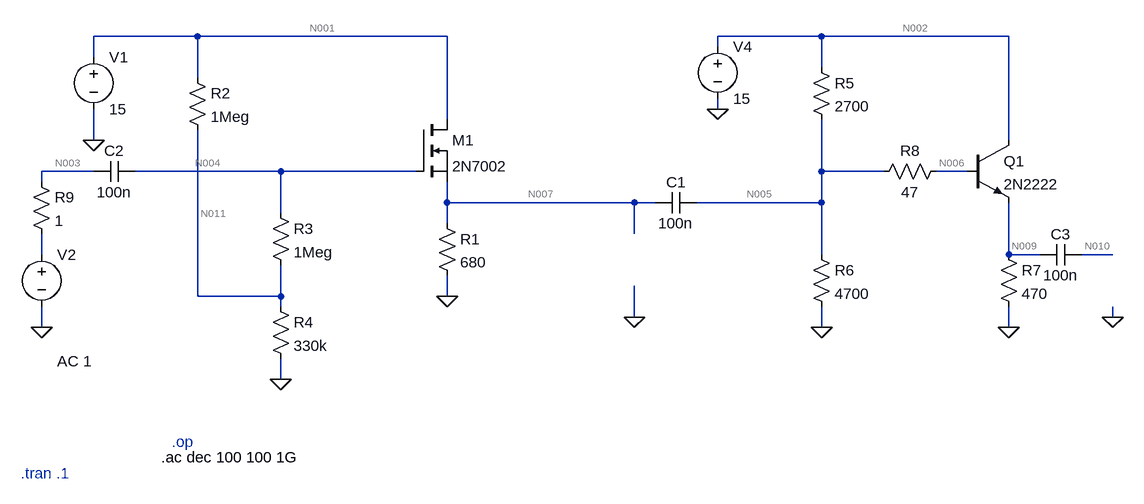
[diagram p0: schematic mosfet 2N7000.asc]
mosfet 2N7000.asc, the LTspice schematic file:
Version 4
SHEET 1 1596 1264
WIRE -176 0 -336 0
WIRE 208 0 -176 0
WIRE 784 0 624 0
WIRE 1072 0 784 0
WIRE 624 16 624 0
WIRE -336 32 -336 0
WIRE 784 48 784 0
WIRE -176 64 -176 0
WIRE 624 112 624 96
WIRE 208 128 208 0
WIRE -336 160 -336 112
WIRE 1072 160 1072 0
WIRE -336 208 -416 208
WIRE -48 208 -272 208
WIRE 160 208 -48 208
WIRE 784 208 784 128
WIRE 880 208 784 208
WIRE 1008 208 960 208
WIRE -416 224 -416 208
WIRE 208 256 208 224
WIRE 496 256 208 256
WIRE 528 256 496 256
WIRE 784 256 784 208
WIRE 784 256 592 256
WIRE -48 272 -48 208
WIRE 208 288 208 256
WIRE 496 304 496 256
WIRE -416 336 -416 304
WIRE 784 336 784 256
WIRE 1072 336 1072 256
WIRE 1120 336 1072 336
WIRE 1232 336 1184 336
WIRE -176 400 -176 144
WIRE -48 400 -48 352
WIRE -48 400 -176 400
WIRE 208 400 208 368
WIRE -48 416 -48 400
WIRE 496 432 496 384
WIRE 1232 432 1232 416
WIRE -416 448 -416 416
WIRE 784 448 784 416
WIRE 1072 448 1072 416
WIRE -48 528 -48 496
FLAG -336 160 0
FLAG -48 528 0
FLAG 208 400 0
FLAG 784 448 0
FLAG 1072 448 0
FLAG -416 448 0
FLAG 496 432 0
FLAG 624 112 0
FLAG 1232 432 0
SYMBOL nmos 160 128 R0
SYMATTR InstName M1
SYMATTR Value 2N7002
SYMBOL res 192 272 R0
SYMATTR InstName R1
SYMATTR Value 680
SYMBOL res -192 48 R0
SYMATTR InstName R2
SYMATTR Value 1Meg
SYMBOL res -64 256 R0
SYMATTR InstName R3
SYMATTR Value 1Meg
SYMBOL res -64 400 R0
SYMATTR InstName R4
SYMATTR Value 330k
SYMBOL res 768 32 R0
SYMATTR InstName R5
SYMATTR Value 2700
SYMBOL res 768 320 R0
SYMATTR InstName R6
SYMATTR Value 4700
SYMBOL res 1056 320 R0
SYMATTR InstName R7
SYMATTR Value 470
SYMBOL res 976 192 R90
WINDOW 0 0 56 VBottom 2
WINDOW 3 32 56 VTop 2
SYMATTR InstName R8
SYMATTR Value 47
SYMBOL npn 1008 160 R0
SYMATTR InstName Q1
SYMATTR Value 2N2222
SYMBOL voltage -336 16 R0
WINDOW 123 0 0 Left 0
WINDOW 39 0 0 Left 0
SYMATTR InstName V1
SYMATTR Value 15
SYMBOL voltage -416 320 R0
WINDOW 3 24 44 Left 2
WINDOW 123 24 180 Left 2
WINDOW 39 0 0 Left 0
SYMATTR Value ""
SYMATTR Value2 AC 1
SYMATTR InstName V2
SYMBOL cap 592 240 R90
WINDOW 0 0 32 VBottom 2
WINDOW 3 32 32 VTop 2
SYMATTR InstName C1
SYMATTR Value 100n
SYMBOL voltage 624 0 R0
WINDOW 123 0 0 Left 0
WINDOW 39 0 0 Left 0
SYMATTR InstName V4
SYMATTR Value 15
SYMBOL res -432 208 R0
SYMATTR InstName R9
SYMATTR Value 1
SYMBOL cap -272 192 R90
WINDOW 0 0 32 VBottom 2
WINDOW 3 32 32 VTop 2
SYMATTR InstName C2
SYMATTR Value 100n
SYMBOL cap 1184 320 R90
WINDOW 0 0 32 VBottom 2
WINDOW 3 32 32 VTop 2
SYMATTR InstName C3
SYMATTR Value 100n
TEXT -216 624 Left 2 ;.op
TEXT -232 648 Left 2 !.ac dec 100 100 1G
TEXT -448 672 Left 2 ;.tran .1

The netlist it stands for:
* mosfet 2N7000.asc
M1 N001 N004 N007 N007 2N7002
R1 N007 0 680
R2 N001 N011 1Meg
R3 N004 N011 1Meg
R4 N011 0 330k
R5 N002 N005 2700
R6 N005 0 4700
R7 N009 0 470
R8 N006 N005 47
Q1 N002 N006 N009 0 2N2222
V1 N001 0 15
V2 N008 0 AC 1
C1 N005 N007 100n
V4 N002 0 15
R9 N003 N008 1
C2 N004 N003 100n
C3 N010 N009 100n
.model NPN NPN
.model PNP PNP
.lib standard.bjt
.model NMOS NMOS
.model PMOS PMOS
.lib standard.mos
* .op
.ac dec 100 100 1G
* .tran .1
.backanno
.end

* Results of the author's LTspice run, read from the files saved beside the schematic
* Operating Point, zero values left out:
*   V(n001) = 15 V
*   V(n004) = 3.722 V
*   V(n007) = 1.953 V
*   V(n011) = 3.722 V
*   V(n002) = 15 V
*   V(n005) = 9.37 V
*   V(n009) = 8.631 V
*   V(n006) = 9.366 V
*   V(n010) = 863.1 nV
*   Ic(Q1) = 18.27 mA
*   Ib(Q1) = 91.48 µA
*   Ie(Q1) = -18.36 mA
*   Id(M1) = 2.872 mA
*   Ig(M1) = -14.34 pA
*   Is(M1) = -2.872 mA
*   I(R8) = -91.48 µA
*   I(R7) = 18.36 mA
*   I(R6) = 1.994 mA
*   I(R5) = 2.085 mA
*   I(R4) = 11.28 µA
*   I(R2) = 11.28 µA
*   I(R1) = 2.872 mA
*   I(V4) = -20.36 mA
*   I(V1) = -2.884 mA
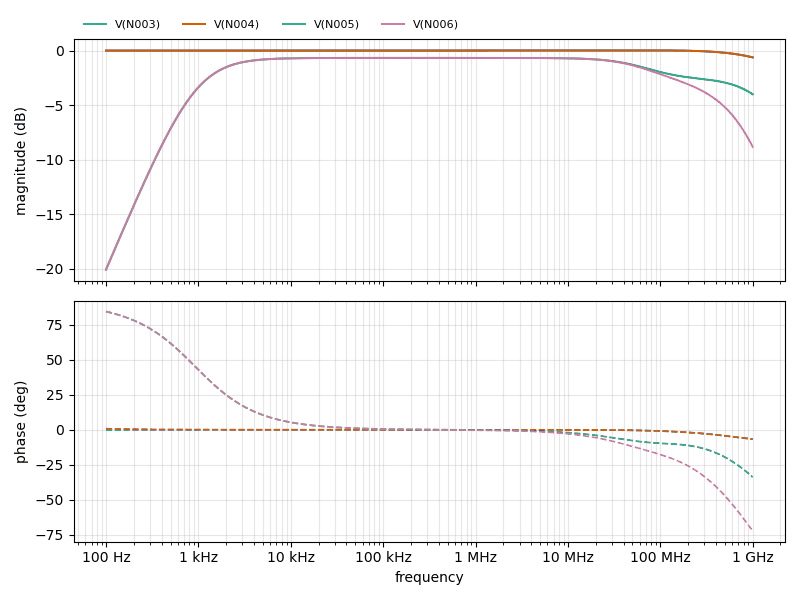
[diagram p1: AC Analysis of mosfet 2N7000.asc, plotted from the saved traces]
* AC Analysis, 1 run:
*   V(N003): -0.00 dB at 100 Hz, -0.62 dB at 1 GHz, peak 0.01 dB at 83.18 MHz
*   V(N004): -0.00 dB at 100 Hz, -0.62 dB at 1 GHz, peak 0.01 dB at 83.18 MHz
*   V(N005): -20.06 dB at 100 Hz, -4.00 dB at 1 GHz, peak -0.67 dB at 316.2 kHz, 3 dB below the peak at 927 Hz and 867.4 MHz
*   V(N006): -20.07 dB at 100 Hz, -8.82 dB at 1 GHz, peak -0.68 dB at 316.2 kHz, 3 dB below the peak at 927 Hz and 283.5 MHz